# Altium project Motor_control.PrjPcb
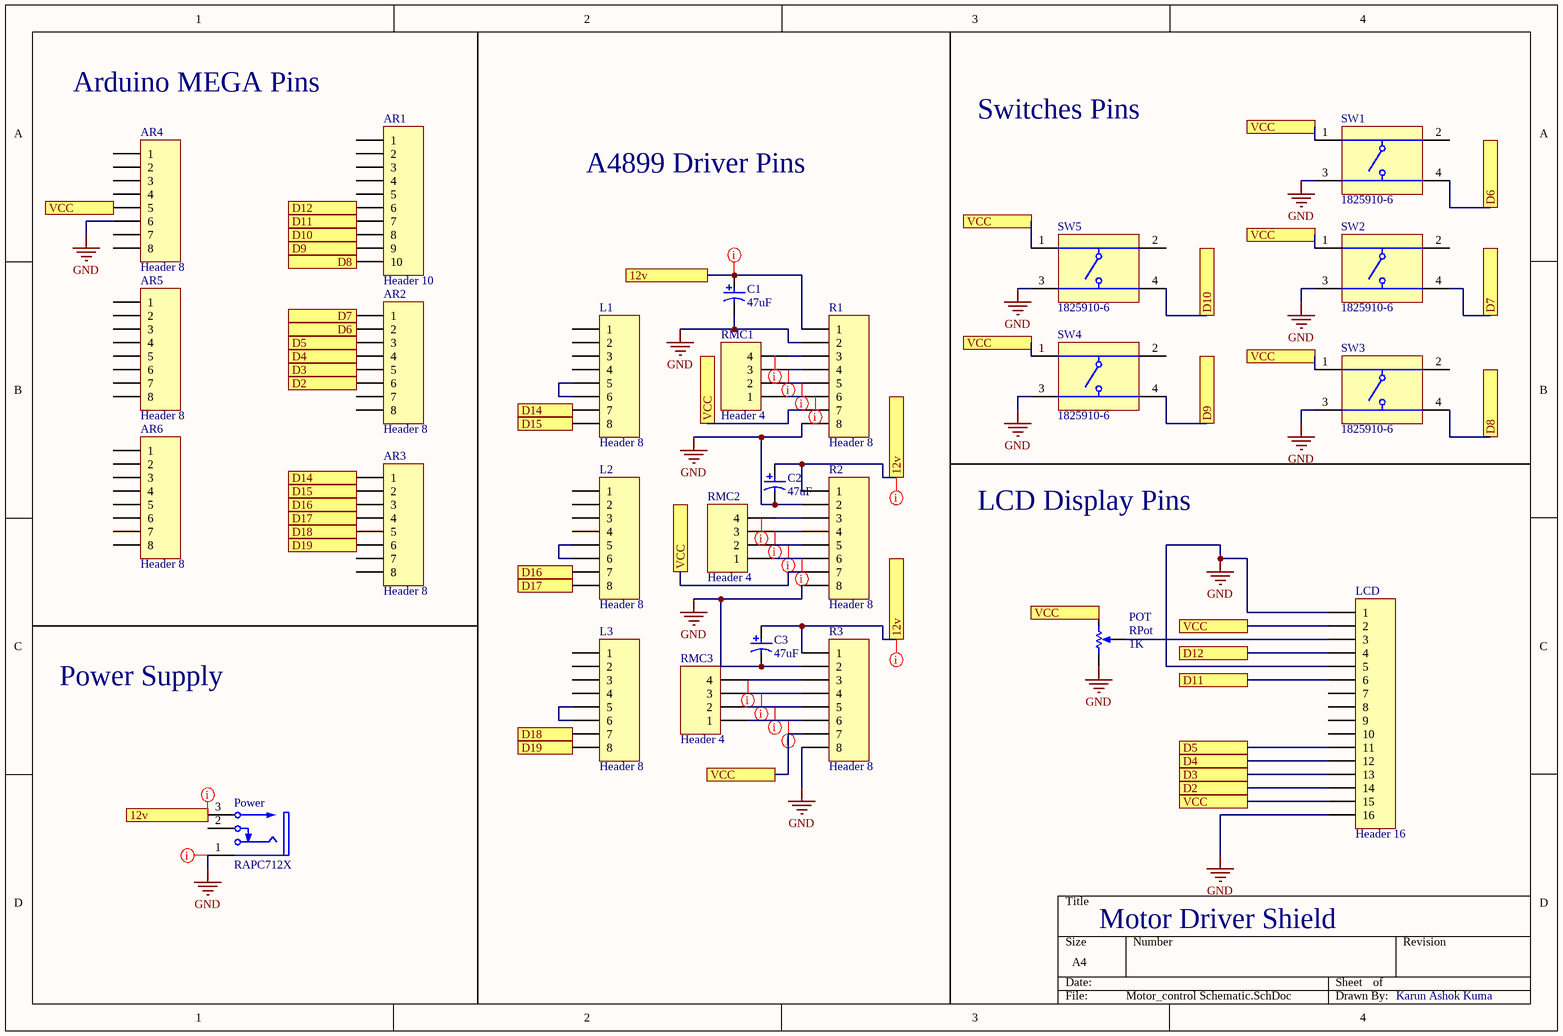
[diagram p0: Motor_control Schematic.SchDoc]
1 sheet, 26 parts. Net scope: flat (ports and power ports of the same name join across sheets).
Board file: Motor_control.PcbDoc

## Sheet Motor_control Schematic.SchDoc
size A4; SheetNumber: 1; SheetTotal: 1

### Parts
AR1  Header 10  [HDR1X10]
AR2  Header 8  [HDR1X8]
AR3  Header 8  [HDR1X8]
AR4  Header 8  [HDR1X8]
AR5  Header 8  [HDR1X8]
AR6  Header 8  [HDR1X8]
C1  47uF  [NIC-UHE-12.5x31.5-2_V]
C2  47uF  [NIC-UHE-12.5x31.5-2_V]
C3  47uF  [NIC-UHE-12.5x31.5-2_V]
L1  Header 8  [HDR1X8]
L2  Header 8  [HDR1X8]
L3  Header 8  [HDR1X8]
LCD  Header 16  [HDR1X16]
POT  RPot  value 1K  [VR5]
Power  RAPC712X  [SWITCH-RAPC712X-3_V]
R1  Header 8  [HDR1X8]
R2  Header 8  [HDR1X8]
R3  Header 8  [HDR1X8]
RMC1  Header 4  [HDR1X4]
RMC2  Header 4  [HDR1X4]
RMC3  Header 4  [HDR1X4]
SW1  1825910-6  [TECO-1825910-6_V]
SW2  1825910-6  [TECO-1825910-6_V]
SW3  1825910-6  [TECO-1825910-6_V]
SW4  1825910-6  [TECO-1825910-6_V]
SW5  1825910-6  [TECO-1825910-6_V]

### Ports
12v, D2, D3, D4, D5, D6, D7, D8, D9, D10, D11, D12, D14, D15, D16, D17, D18, D19, VCC

### Nets
GND: AR4.6 C1.2 C2.2 C3.2 LCD.1 LCD.5 LCD.16 POT.1(TOP) Power.1 R1.2 R1.8 R2.2 R2.8 R3.2 R3.8 SW1.3 SW2.3 SW3.3 SW4.3 SW5.3
NetAR1_6: AR1.6 LCD.4 ; port D12
NetAR1_7: AR1.7 LCD.6 ; port D11
NetAR1_8: AR1.8 SW5.4 ; port D10
NetAR1_9: AR1.9 SW4.4 ; port D9
NetAR1_10: AR1.10 SW3.4 ; port D8
NetAR2_1: AR2.1 SW2.4 ; port D7
NetAR2_2: AR2.2 SW1.4 ; port D6
NetAR2_3: AR2.3 LCD.11 ; port D5
NetAR2_4: AR2.4 LCD.12 ; port D4
NetAR2_5: AR2.5 LCD.13 ; port D3
NetAR2_6: AR2.6 LCD.14 ; port D2
NetAR3_1: AR3.1 L1.7 ; port D14
NetAR3_2: AR3.2 L1.8 ; port D15
NetAR3_3: AR3.3 L2.7 ; port D16
NetAR3_4: AR3.4 L2.8 ; port D17
NetAR3_5: AR3.5 L3.7 ; port D18
NetAR3_6: AR3.6 L3.8 ; port D19
NetAR4_5: AR4.5 LCD.2 LCD.15 POT.2(BOT) R1.7 R2.7 R3.7 SW1.1 SW2.1 SW3.1 SW4.1 SW5.1 ; port VCC
NetC1_1: C1.1 C2.1 C3.1 Power.3 R1.1 R2.1 R3.1 ; port 12v
NetL1_5: L1.5 L1.6
NetL2_5: L2.5 L2.6
NetL3_5: L3.5 L3.6
NetLCD_3: LCD.3 POT.3(TAP)
NetR1_3: R1.3 RMC1.4
NetR1_4: R1.4 RMC1.3
NetR1_5: R1.5 RMC1.2
NetR1_6: R1.6 RMC1.1
NetR2_3: R2.3 RMC2.4
NetR2_4: R2.4 RMC2.3
NetR2_5: R2.5 RMC2.2
NetR2_6: R2.6 RMC2.1
NetR3_3: R3.3 RMC3.4
NetR3_4: R3.4 RMC3.3
NetR3_5: R3.5 RMC3.2
NetR3_6: R3.6 RMC3.1

Not connected (* = marked no-connect by the designer): AR1 1 2 3 4 5; AR2 7 8; AR3 7 8; AR4 1 2 3 4 7 8; AR5 1 2 3 4 5 6 7 8; AR6 1 2 3 4 5 6 7 8; L1 1 2 3 4; L2 1 2 3 4; L3 1 2 3 4; LCD 7 8 9 10; Power 2; SW1 2; SW2 2; SW3 2; SW4 2; SW5 2

### Layout directives
rule Width Constraint [Pref Width = 45mil    Min Width = 45mil    Max Width = 10mil]: GND, NetC1_1
rule Width Constraint [Pref Width = 45mil    Min Width = 45mil    Max Width = 45mil]: (no net found under the mark), NetC1_1, NetR1_4, NetR1_5, NetR2_4, NetR2_5, NetR2_6, NetR3_3, NetR3_4, NetR3_5, NetR3_6

### Notes on the sheet
- Arduino MEGA Pins
- A4899 Driver Pins
- Switches Pins
- LCD Display Pins
- Power Supply
- Motor Driver Shield
- Karun Ashok Kuma

### Library data of the parts
AR1 = Header 10: Header, 10-Pin; LatestRevisionDate: 17-Jul-2002; LatestRevisionNote: Re-released for DXP Platform.; Publisher: Altium Limited
AR2-AR6 L1-L3 R1-R3 = Header 8: Header, 8-Pin; LatestRevisionDate: 17-Jul-2002; LatestRevisionNote: Re-released for DXP Platform.; Publisher: Altium Limited
C1-C3 = CMP-1253-00001-1: Aluminum Electrolytic Capacitor, 680 uF +/-20%, 50 V, -40 to 105 degC, 2-Pin THD, RoHS, Bulk; Manufacturer: Nichicon; PartNumber: UHE1H681MHD; Rated Ripple: 2310 mA; Rated Capacitance: 680 uF; Rated Voltage: 50 V; RoHS: TRUE; Mounting Technology: Through Hole; PackageDescription: 2-Pin Through Hole Device, Dia 12.5 mm, Body Length 31.5 mm, Pin Spacing 5 mm; ComponentLink3Description: Package Specification; DatasheetVersion: Sep-13; Temperature Range: -40 to 105 degC; ComponentLink1Description: Manufacturer URL; Capacitance Tolerance: +/-20%; ComponentLink1URL: http://www.nichicon.co.jp/; ComponentLink2URL: http://nichicon-us.com/english/products/pdfs/e-he.pdf; ComponentLink3URL: http://nichicon-us.com/english/products/pdfs/e-he.pdf; ComponentLink2Description: Datasheet; Packing: Bulk
LCD = Header 16: Header, 16-Pin; LatestRevisionDate: 17-Jul-2002; LatestRevisionNote: Re-released for DXP Platform.; Publisher: Altium Limited
POT = RPot: Potentiometer; Sim Note: Enter the Resistance value and the set point into parameter fields.; Set Position: 0.5; Published: 8-Jun-2000; LatestRevisionDate: 17-Jul-2002; LatestRevisionNote: Re-released for DXP Platform.; PackageReference: VR5; Publisher: Altium Limited; PackageDescription: Variable Resistor, Thru-Hole; 3 Leads
Power = CMP-2000-05383-1: Conn Powerjack Mini R/A PCMT, 5 A, 3-Pin THD, RoHS; Manufacturer: Switchcraft; Gender: Male; Current Rating: 5A; Connector Type: Jack; Dynamic Catalog: SwitchcraftInc; Other Names: Q2387461 / Q2526383 / RAPC712X-ND / SC237; Internal Switch(s): SingleSwitch,NormallyClosed; Catalog Drawings: RAPC7(1,2)2XSide / RAPC7(1,2)2XTop; Plug/Mating Plug Diameter: 2.5mmID,5.5mmOD; Number of Positions/Contacts: 2Conductors,2Contacts; Shielding: Unshielded; Mating Products: SC1539-ND / -CONNPLUGMINIPWR2CONDBLK/RED / SC1051-ND / -CONNPLUGMINIPOWER2CONDBLACK; Mounting Type: ThroughHole,RightAngle; Manufacturer URL: http://www.switchcraft.com/; Contact Material: Brass; Standard Package: 2,500; RoHS Information: SwitchcraftRoHSInfo; Termination: SolderEyelet(s); Housing Color: Black; Datasheet Version: Rev. A, 08/2005; Family: Barrel-PowerConnectors; Housing Material: Thermoplastic; Color: Black; Datasheet URL: https://datasheet.ciiva.com/391/rapc712x-cd-391666.pdf; Category: Connectors,Interconnects; Contact Material - Plating: Nickel
RMC1-RMC3 = Header 4: Header, 4-Pin; LatestRevisionDate: 17-Jul-2002; LatestRevisionNote: Re-released for DXP Platform.; Publisher: Altium Limited
SW1-SW5 = CMP-1684-00021-1: Tact Switch, SPST-NO, 0.05 A, -35 to 85 degC, 4-Pin THD, RoHS, Bulk; Manufacturer: TE Connectivity; Maximum Contact Resistance: 100mOhm; Mechanical Life: 100000Cycles; Bushing Type: Unthreaded; Switch Configuration: OFF(ON); Maximum DC Voltage Rating: 24V; Contact Rating @ Voltage: 0.05A@24VDC; Actuator Color: Black; Body Orientation: Straight; Function: MomentaryContact; Illumination: N/R; Actuator Style: RoundButton; Actuator Material: PolybutyleneTerephthalate; Dielectric Strength: 500VAC; Pole Throw Configuration: SPST; Actuator Length: 1.4mm; Product Weight: N/A; Contact Material: CopperAlloy; Housing Material: N/A; Terminal Type: PCPins; Minimum Insulation Resistance: 100MOhm; Package Description: 4-Pin Through Hole Device, Body 5.99 x 5.99 mm, Pitch 6.5 mm; Part No: 1825910-6; Package Reference: THD; Base Material: N/A; Manufacturer URL: http://www.te.com; Contact Plating: Silver; RoHS: Yes; Datasheet Version: Rev. C9; Electrical Life: 100000Cycles; Maximum AC Voltage Rating: N/A; Thread Size: N/R; Operating Temperature: -35to85C; Mounting: ThroughHole; Dimension: 5.99x5mm; Datasheet URL: http://www.te.com/commerce/DocumentDelivery/DDEController?Action=showdoc&DocId=Customer+Drawing%7F1825910%7FC9%7Fpdf%7FEnglish%7FENG_CD_1825910_C9.pdf%7F1825910-6; Family: 1825910; Seal Location: N/A; Seal Description: N/A; Packaging: N/A